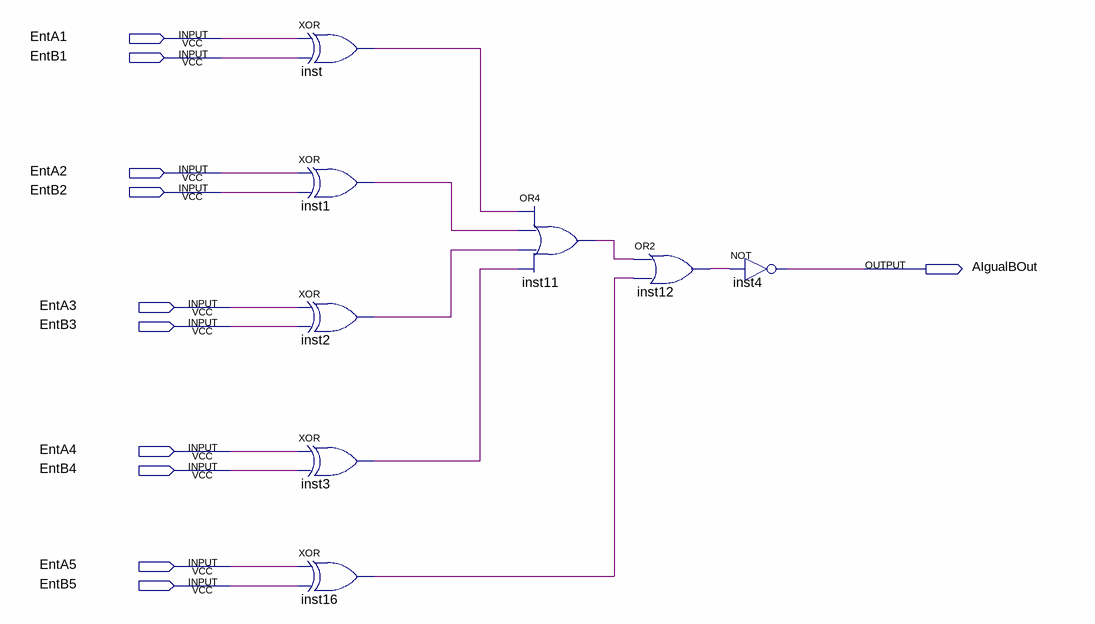
[diagram p0: schematic sheet]
// Quartus schematic CompAB.bdf as structural Verilog: 8 symbols, 11 pins
module CompAB (
  input  EntA1,
  input  EntB1,
  input  EntA2,
  input  EntB2,
  input  EntA3,
  input  EntB3,
  input  EntA4,
  input  EntB4,
  input  EntA5,
  input  EntB5,
  output AIgualBOut
);

  wire inst1_out, inst2_out, inst3_out, inst11_out, inst12_out, inst16_out, inst_out;

  xor inst (inst_out, EntA1, EntB1);
  xor inst1 (inst1_out, EntA2, EntB2);
  xor inst2 (inst2_out, EntA3, EntB3);
  xor inst3 (inst3_out, EntA4, EntB4);
  xor inst16 (inst16_out, EntA5, EntB5);
  or inst11 (inst11_out, inst_out, inst1_out, inst2_out, inst3_out);
  or inst12 (inst12_out, inst11_out, inst16_out);
  not inst4 (AIgualBOut, inst12_out);
endmodule
